# Altium schematic sheet MAX7219CWG+.SchDoc
size A4
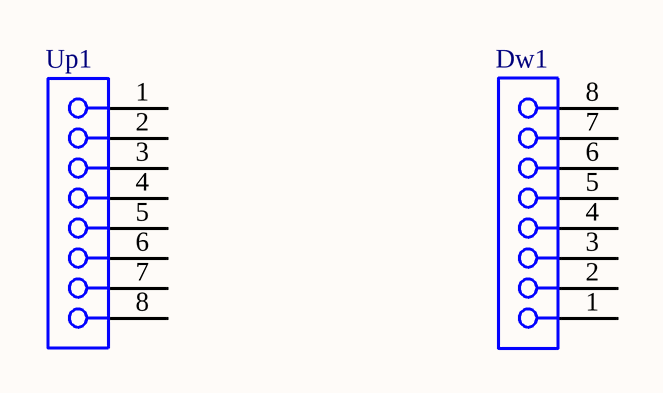
[diagram p0: MAX7219CWG+.SchDoc]

## Parts
Dw1  SSQ-108-01-G-S  [SMTC-SSQ-108-01-X-S]  (value not drawn)
Up1  SSQ-108-01-G-S  [SMTC-SSQ-108-01-X-S]  (value not drawn)

## Nets

Not connected (* = marked no-connect by the designer): Dw1 1 2 3 4 5 6 7 8; Up1 1 2 3 4 5 6 7 8

## Library data of the parts
Dw1 Up1 = CMP-1023-00292-1: SQ Post Socket, Through-hole, Vertical, -55 to 125 degC, 2.54 mm Pitch, 8-Pin, Female, RoHS; Manufacturer: Samtec; Pitch: 2.54 mm; ComponentLink3URL: http://www.samtec.com/documents/webfiles/cpdf/SSQ-1XX-XX-XXX-X-XX-XXX-XX-X-MKT.pdf; ComponentLink3Description: Package Specification; RoHS: True; ComponentLink1URL: http://www.samtec.com; Mounting Technology: Through-hole; PackageVersion: BD, 6/1987; ComponentLink1Description: Manufacturer URL; PartNumber: SSQ-108-01-G-S; ComponentLink2Description: Datasheet; Temperature Range: -55 to 125 degC; ComponentLink2URL: http://www.samtec.com/documents/webfiles/pdf/SSQ_TH.PDF; PackageDescription: Assembly, Socket Strip .025[0.64] SQ Tail; PackageReference: SSQ-108-01-X-S; Orientation: Vertical; DatasheetVersion: F-214